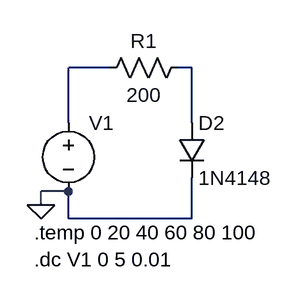
[diagram p0: schematic 141_TempSweep.asc]
141_TempSweep.asc, the LTspice schematic file:
Version 4
SHEET 1 880 680
WIRE 224 240 176 240
WIRE 320 240 304 240
WIRE 176 304 176 240
WIRE 320 304 320 240
WIRE 176 384 144 384
WIRE 144 400 144 384
WIRE 176 416 176 384
WIRE 320 416 320 368
WIRE 320 416 176 416
FLAG 144 400 0
SYMBOL voltage 176 288 R0
SYMATTR InstName V1
SYMATTR Value ""
SYMBOL diode 304 304 R0
SYMATTR InstName D2
SYMATTR Value 1N4148
SYMBOL Res 320 224 R90
WINDOW 0 0 56 VBottom 2
WINDOW 3 32 56 VTop 2
SYMATTR InstName R1
SYMATTR Value 200
TEXT 136 432 Left 2 !.temp 0 20 40 60 80 100\n.dc V1 0 5 0.01

The netlist it stands for:
* 141_TempSweep.asc
V1 N001 0
D2 N002 0 1N4148
R1 N002 N001 200
.model D D
.lib standard.dio
.temp 0 20 40 60 80 100
.dc V1 0 5 0.01
.backanno
.end